# EAGLE design supplyv3 (EAGLE 5.11)
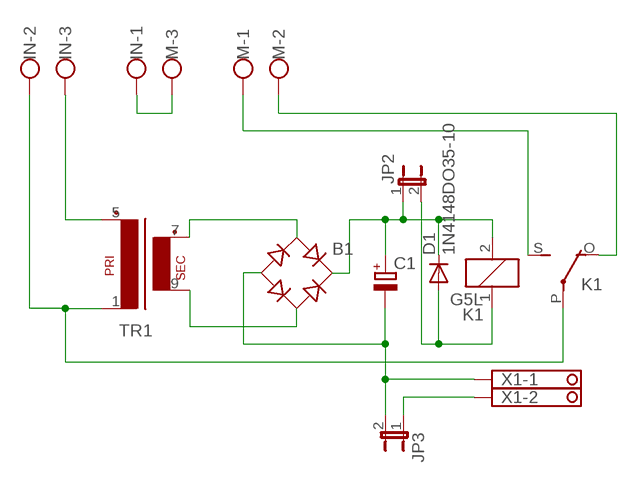
[diagram p0: schematic, sheet 1]

## Parts
B1  B-DIL  [B-DIL]
C1  CPOL-EUE5-10.5  [E5-10,5]
D1  1N4148DO35-10  [DO35-10]
IN  W237-103  [W237-103]
JP2  JP1E  [JP1]
JP3  JP1E  [JP1]
K1  G5L  [G5LE]
M  W237-103  [W237-103]
TR1  EI30-1  [EI30-1]
X1  1751248  [1751248]

## Nets
N: IN.1 M.3
N$1: B1.AC1 TR1.7(S3)
N$2: B1.AC2 TR1.9(S4)
N$3: B1.+ C1.+ D1.C JP2.1 K1.2
N$4: B1.- C1.- JP3.2 X1.1
N$5: JP3.1 X1.2
N$6: IN.3 TR1.5(P2)
N$7: K1.S(2:S) M.1
N$8: IN.2 K1.P(2:P) TR1.1
N$10: K1.O(2:O) M.2
N$13: D1.A JP2.2 K1.1

## Library data of the parts
B1 = rectifier:B-DIL: RECTIFIER
C1 = rcl:CPOL-EU: POLARIZED CAPACITOR, European symbol
D1 = diode:1N4148: DIODE high speed (Philips)
IN M = con-wago-500:W237-103: WAGO SCREW CLAMP
JP2 JP3 = jumper:JP1E: JUMPER
K1 = relay:G5L: RELAY 1 x switch, 10 A/120 V AC, 8 A/30 V ADC, Omron
TR1 = trafo:EI30-1: TRANSFORMER 1 primary winding, 1 secondary winding ERA
X1 = con-phoenix-350:1751248: MKDS 1/ 2-3,5 Printklemme Nennstrom: 10 A Bemessungsspannung: 160 V Raster: 3,5 mm Polzahl: 2 Montageart: Löten Anschlussart: Schraubanschluss Anschlussrichtung vom Leiter zur Platine: 0° Source: http://eshop.phoenixcontact.com .. 1751248.pdf; OC_FARNELL: unknown; OC_NEWARK: unknown

## Board
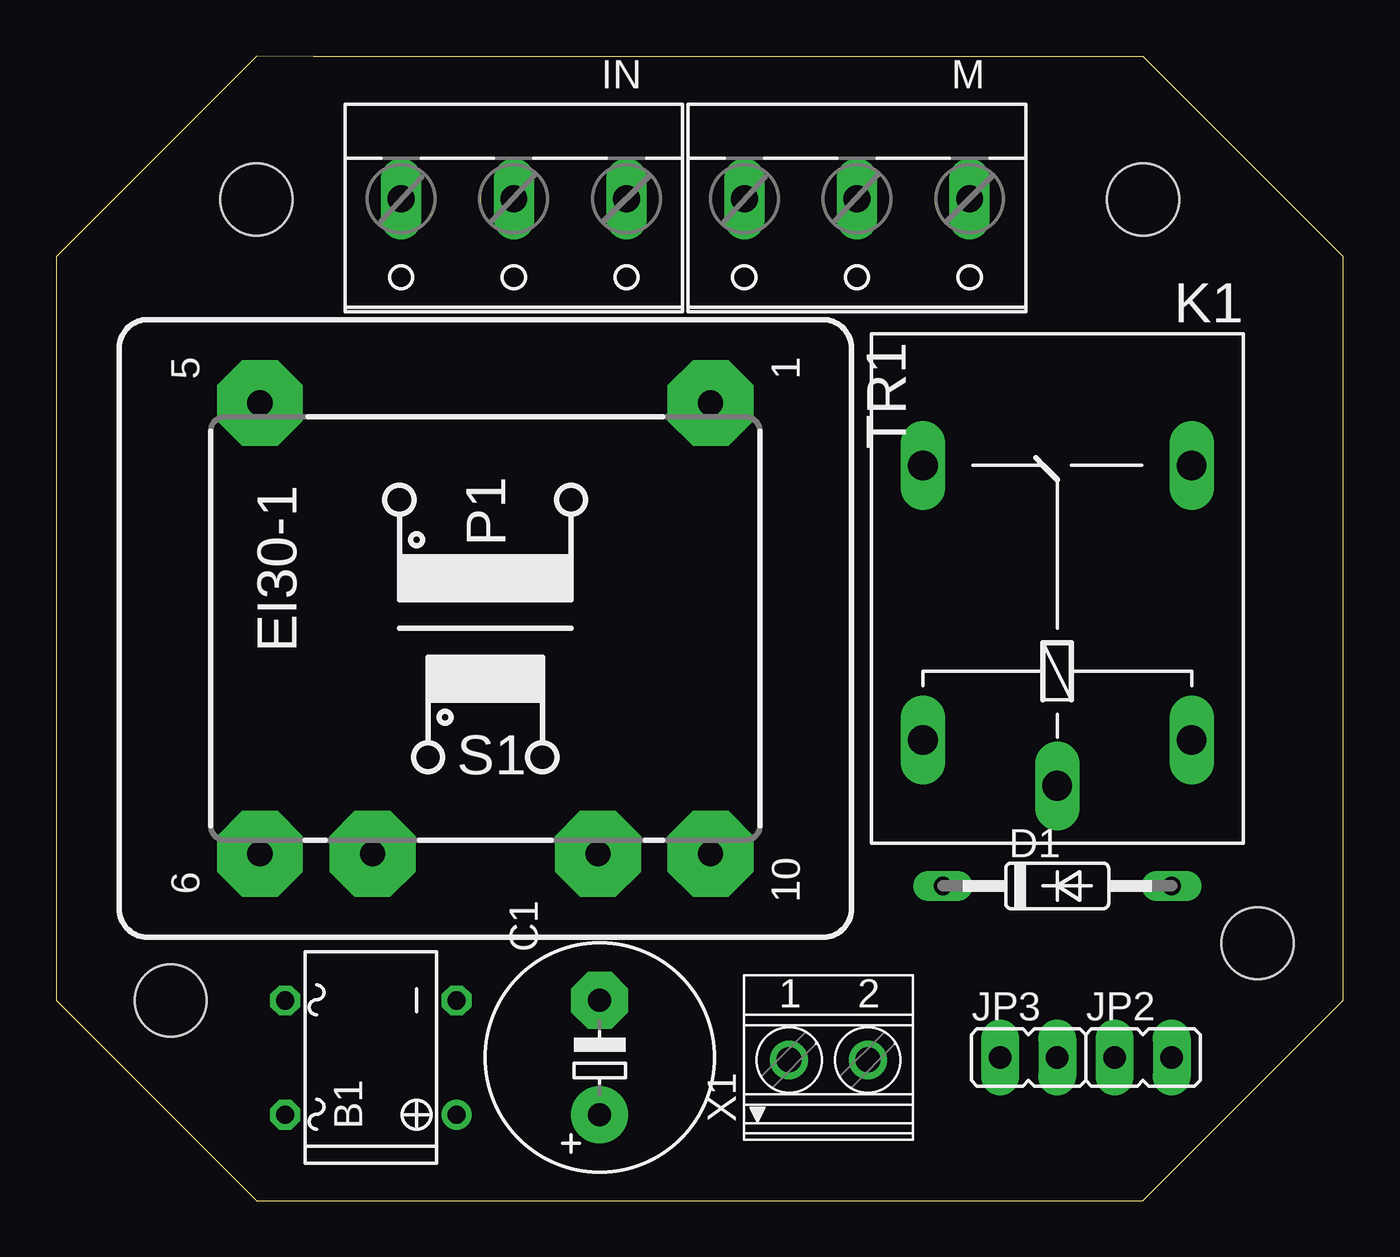
[diagram p1: board, top side]
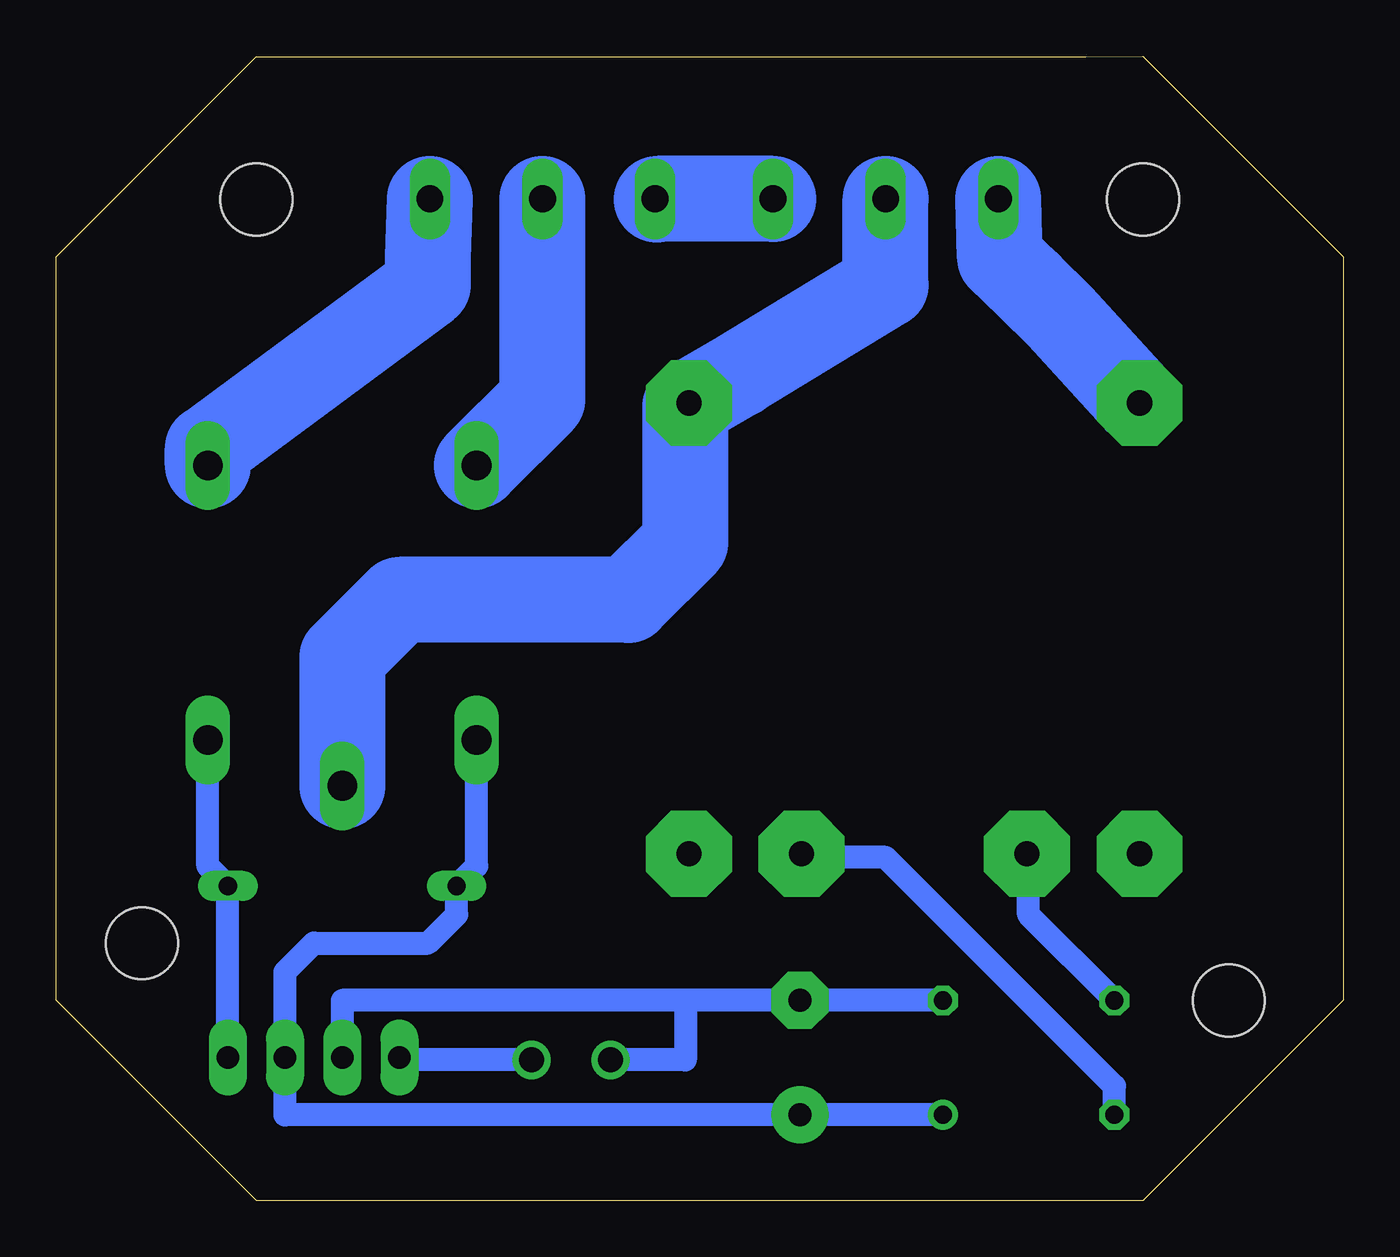
[diagram p2: board, bottom side, seen from below]

Size 57.15 x 50.8 mm. Coordinates in mm from the lower left corner, seen from the top.
Outline: 48.26,0 57.15,8.89 57.15,41.91 48.27,50.79 11.43,50.79 8.89,50.8 0,41.91 0,8.89 8.89,0 48.26,0
Copper layers (1*16): Top 0.035mm / dielectric 1.5mm / Bottom 0.035mm
Design rules "default": minimum track width 10mil, minimum drill 24mil, track to track 8mil, track to pad 8mil, pad to pad 8mil, via to via 8mil, smd to smd 8mil, copper to edge 40mil, drill to drill 8mil, minimum pad ring 10mil, minimum via ring 8mil, stop-mask expansion 4mil, vias tented up to drill 0mil, thermal gap 10mil
Holes 3.2 mm at 5.08,8.89 8.89,44.45 48.26,44.45 53.34,11.43

### Footprints (pad centres in the part's own frame; a part is rotated, then mirrored left to right if it is on the bottom)
B-DIL = drill 0.813 round: + -2.54,-3.81 | drill 0.813 octagon: - 2.54,-3.81; AC1 2.54,3.81; AC2 -2.54,3.81
E5-10,5 = drill 1.016 pad 2.54 round: + -2.54,0 | drill 1.016 pad 2.54 octagon: - 2.54,0
DO35-10 = drill 0.813 long: A 5.08,0; C -5.08,0
W237-103 = drill 1.194 long: 1 -5,-1.29; 2 0,-1.29; 3 5,-1.29
JP1 = drill 1 pad 1.676 long: 1 0,-1.27; 2 0,1.27
G5LE = drill 1.321 long: 1 -7.493,-5.969; 2 -7.493,5.969; O 4.699,5.969; P -9.525,0; S 4.699,-5.969
EI30-1 = drill 1.118 pad 3.81 octagon: 1 -10.008,10.008; 5 -10.008,-10.008; 6 10.008,-10.008; 7 10.008,-5.004; 9 10.008,5.004; 10 10.008,10.008
1751248 = drill 1.1 pad 1.7 round: 1 -1.75,-0.1; 2 1.75,-0.1

### Placement (x,y rotation side)
B1  13.97,6.35 90 top
C1  24.13,6.35 90 top
D1  44.45,13.97 0 top
IN  20.32,43.18 180 top
JP2  48.26,6.35 270 top
JP3  43.18,6.35 270 top
K1  44.45,27.94 90 top
M  35.56,43.18 180 top
TR1  19.05,25.4 270 top
X1  34.29,6.35 0 top

### Tracks (layer width: path | path; a pad name or v marks a point on that pad's centre or on a via)
N
  Bottom 0.254: 30.48,44.45 M.3
  Bottom 3.81: IN.1 30.46,44.47 30.48,44.45
N$1
  Bottom 0.406: 13.97,15.32 TR1.7
  Bottom 1.016: B1.AC1 13.97,12.7 13.97,15.32
N$2
  Bottom 0.406: 23.9,15.24 TR1.9
  Bottom 1.016: B1.AC2 10.16,5.08 20.32,15.24 23.9,15.24
N$3
  Bottom 0.406: 46.99,5.08 JP2.1
  Bottom 1.016: B1.+ C1.+ 46.99,3.81 46.99,5.08 | JP2.1 46.99,10.16 45.72,11.43 40.64,11.43 39.37,12.7 D1.C 38.48,14.86 K1.2
N$4
  Bottom 1.016: B1.- C1.- 29.21,8.89 | 29.21,8.89 44.45,8.89 JP3.2 | X1.1 29.21,6.25 29.21,8.89
N$5
  Bottom 0.406: 41.81,6.25 JP3.1
  Bottom 1.016: X1.2 41.81,6.25
N$6
  Bottom 3.81: TR1.5 12.55,39.22 13.97,40.64 15.24,41.85 IN.3
N$7
  Bottom 3.81: K1.S 50.42,33.4 40.64,40.64 40.64,41.85 M.1
N$8
  Bottom 3.81: IN.2 20.32,40.64 26.82,36.68 TR1.1 29.21,35.26 29.21,29.21 31.75,26.67 41.91,26.67 44.45,24.13 K1.P
N$10
  Bottom 3.81: K1.O 35.56,35.56 M.2
N$13
  Bottom 1.016: JP2.2 D1.A 50.42,14.86 K1.1